# Altium schematic sheet 3v3BuckConverterTPS62056.SchDoc
size C; SheetNumber: 2; SheetTotal: 2
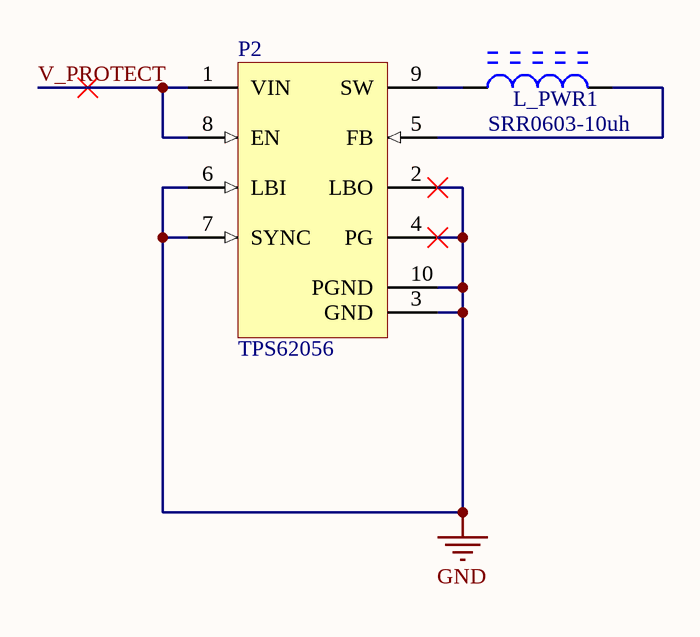
[diagram p0: 3v3BuckConverterTPS62056.SchDoc]

## Parts
L_PWR1  SRR0603-10uh  [BOUR-SRR0603_V]
P2  TPS62056  [DGS10_L]

## Nets
GND: P2.2(LBO) P2.3(GND) P2.4(PG) P2.6(LBI) P2.7(SYNC) P2.10(PGND)
V_PROTECT: P2.1(VIN) P2.8(EN)
NetL_PWR1_1: L_PWR1.1 P2.9(SW)
NetL_PWR1_2: L_PWR1.2 P2.5(FB)

## Library data of the parts
L_PWR1 = CMP-2000-07145-1: Shielded Power Inductor, 10 uH, +/- 20%, -40 to 125 degC, 2-Pin SMD, RoHS, Tape and Reel; Manufacturer: Bourns; 3D Model: SRR0603.stp; Inductance: 10µH; Other Names: SRR0603-100MLTR / SRR0603100ML; DC Resistance (DCR): 120mOhmMax; Product Training Modules: MagneticProductOverview; Current - Saturation: 1.5A; PCN Assembly/Origin: MagneticproductsOct/2013; Frequency - Test: 1kHz; Material - Core: Ferrite; Online Catalog: SRRSeries; Current Rating: 1.1A; Frequency - Self Resonant: 25MHz; EDA / CAD Models: DownloadfromAcceleratedDesigns; Q @ Freq: 16@2.52MHz; Manufacturer URL: http://www.bourns.com/; Mounting Technology: SurfaceMount; Datasheet URL: http://www.bourns.com/docs/Product-Datasheets/SRR0603.pdf; Standard Package: 1,000; Package Description: 2-Pin Surface Mount Device, Body 6.5 x 6.5 mm; RoHS Information: SRR0603SeriesMaterialDeclaration; Category: Inductors,Coils,Chokes; Package / Case: Nonstandard; Operating Temperature: -40°C~125°C; Series: SRR0603; Tolerance: ±20%; Height - Seated (Max): 0.130"(3.30mm); Packaging: Tape&Reel(TR); Shielding: Shielded; Family: FixedInductors; Package Reference: SRR00603; Size / Dimension: 0.256"Lx0.256"W(6.50mmx6.50mm); Datasheet Version: 09/2011; Type: Wirewound; Mounting Type: SurfaceMount
P2 = CMP-0323-00472-2: Buck Step Down Regulator with 2.7 to 10 V Input and 3.3 V Output, -40 to 85 degC, 10-Pin MSOP (DGS), Green (RoHS & no Sb/Br); Manufacturer: Texas Instruments; PartNumber: TPS62056DGSRG4; Vin(Min)(V): 2.7; Duty Cycle(Max)(%): 100; Switch Current Limit(Typ)(A): 1.4; Vin(Max)(V): 10; Rating: Catalog; Vout(Max)(V): 3.3; Synchronous Rectification: TRUE; Iq(Typ)(mA): 0.012; SubFamily: Step-Down Regulator; Regulated Outputs(#): 1; Iout(Max)(A): 0.8; Code_JEDEC: MO-187-BA; ComponentLink2URL: http://www.ti.com/litv/pdf/mpds373; Topology: Buck; ComponentLink3URL: Samples URL:http://www.ti.com/product/tps62056#samples; PackageVersion: revC, Feb-2004; PackageReference: DGS10; PackageDescription: 10-Pin Thin Shrink Small Outline Package 0.5 mm Pitch; ComponentLink2Description: Package Specification; Preset Vout(V): 3.3; ComponentLink1URL: http://www.ti.com/general/docs/lit/getliterature.tsp?genericPartNumber=TPS62056&fileType=pdf; ComponentLink3Description: URL Link1; ComponentLink1Description: Datasheet; Eco-Plan: Green (RoHS & no Sb/Br); DatasheetVersion: SLVS432E; Mounting Technology: Surface Mount; Vout(Min)(V): 3.3